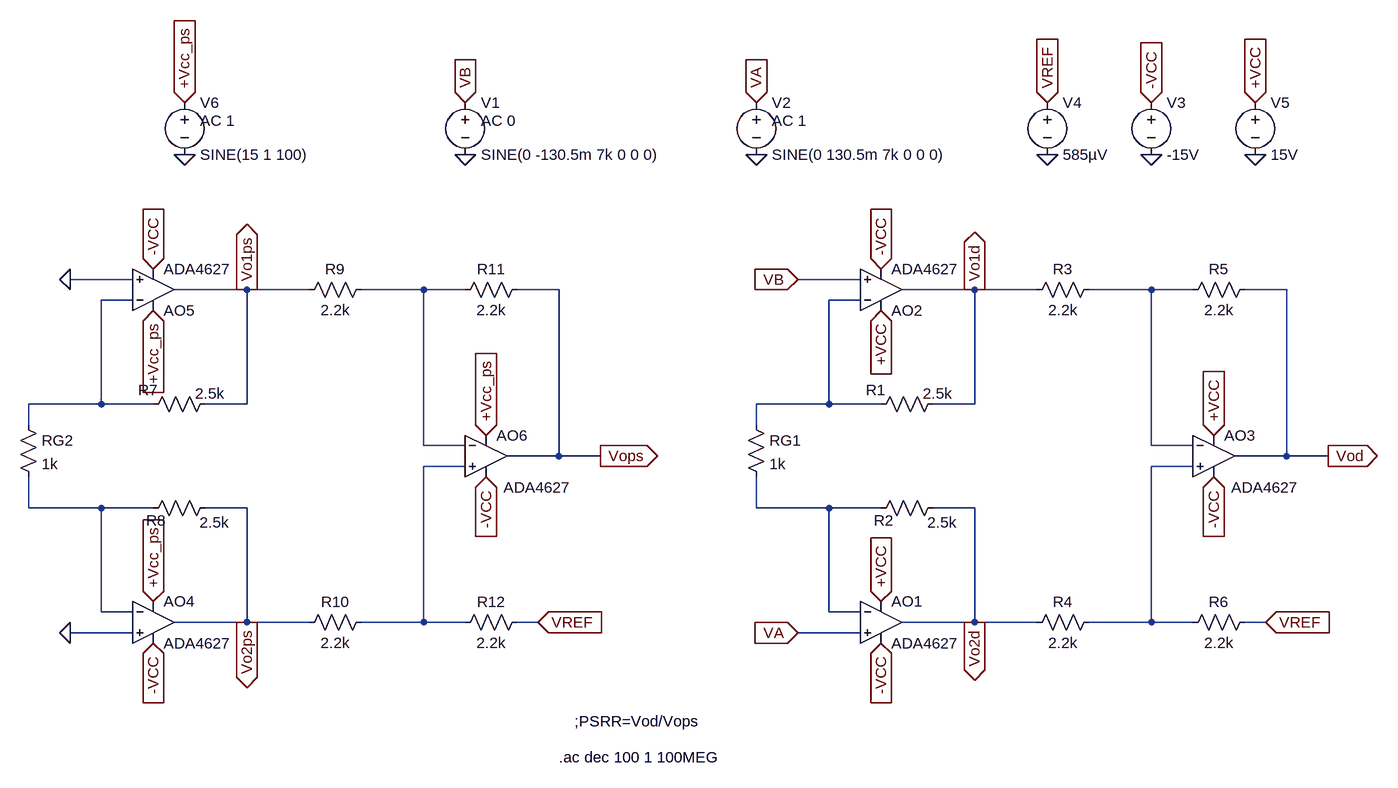
[diagram p0: schematic PSRR.asc]
PSRR.asc, the LTspice schematic file:
Version 4.1
SHEET 1 880 680
WIRE -1760 -160 -1856 -160
WIRE -640 -160 -736 -160
WIRE -1584 -144 -1696 -144
WIRE -1488 -144 -1584 -144
WIRE -1312 -144 -1408 -144
WIRE -1248 -144 -1312 -144
WIRE -1104 -144 -1168 -144
WIRE -464 -144 -576 -144
WIRE -368 -144 -464 -144
WIRE -192 -144 -288 -144
WIRE -128 -144 -192 -144
WIRE 16 -144 -48 -144
WIRE -1760 -128 -1808 -128
WIRE -640 -128 -688 -128
WIRE -1808 32 -1808 -128
WIRE -1808 32 -1920 32
WIRE -1728 32 -1808 32
WIRE -1584 32 -1584 -144
WIRE -1584 32 -1648 32
WIRE -688 32 -688 -128
WIRE -688 32 -800 32
WIRE -608 32 -688 32
WIRE -464 32 -464 -144
WIRE -464 32 -528 32
WIRE -1920 64 -1920 32
WIRE -800 64 -800 32
WIRE -1312 96 -1312 -144
WIRE -1248 96 -1312 96
WIRE -192 96 -192 -144
WIRE -128 96 -192 96
WIRE -1104 112 -1104 -144
WIRE -1104 112 -1184 112
WIRE -1040 112 -1104 112
WIRE 16 112 16 -144
WIRE 16 112 -64 112
WIRE 80 112 16 112
WIRE -1248 128 -1312 128
WIRE -128 128 -192 128
WIRE -1920 192 -1920 144
WIRE -1808 192 -1920 192
WIRE -1728 192 -1808 192
WIRE -1584 192 -1648 192
WIRE -800 192 -800 144
WIRE -688 192 -800 192
WIRE -608 192 -688 192
WIRE -464 192 -528 192
WIRE -1808 352 -1808 192
WIRE -1760 352 -1808 352
WIRE -688 352 -688 192
WIRE -640 352 -688 352
WIRE -1584 368 -1584 192
WIRE -1584 368 -1696 368
WIRE -1488 368 -1584 368
WIRE -1312 368 -1312 128
WIRE -1312 368 -1408 368
WIRE -1248 368 -1312 368
WIRE -1136 368 -1168 368
WIRE -464 368 -464 192
WIRE -464 368 -576 368
WIRE -368 368 -464 368
WIRE -192 368 -192 128
WIRE -192 368 -288 368
WIRE -128 368 -192 368
WIRE -16 368 -48 368
WIRE -1760 384 -1856 384
WIRE -640 384 -736 384
FLAG -736 -160 VB
IOPIN -736 -160 In
FLAG -736 384 VA
IOPIN -736 384 In
FLAG -608 -176 -VCC
IOPIN -608 -176 In
FLAG -608 -112 +VCC
IOPIN -608 -112 In
FLAG -608 400 -VCC
IOPIN -608 400 In
FLAG -608 336 +VCC
IOPIN -608 336 In
FLAG -16 368 VREF
IOPIN -16 368 In
FLAG -464 -144 Vo1d
IOPIN -464 -144 Out
FLAG -464 368 Vo2d
IOPIN -464 368 Out
FLAG -96 144 -VCC
IOPIN -96 144 In
FLAG -96 80 +VCC
IOPIN -96 80 In
FLAG 80 112 Vod
IOPIN 80 112 Out
FLAG -1248 -352 0
FLAG -1248 -432 VB
IOPIN -1248 -432 In
FLAG -800 -352 0
FLAG -800 -432 VA
IOPIN -800 -432 In
FLAG -192 -352 0
FLAG -32 -352 0
FLAG -32 -432 +VCC
IOPIN -32 -432 In
FLAG -192 -432 -VCC
IOPIN -192 -432 In
FLAG -352 -352 0
FLAG -352 -432 VREF
IOPIN -352 -432 In
FLAG -1728 -176 -VCC
IOPIN -1728 -176 In
FLAG -1728 400 -VCC
IOPIN -1728 400 In
FLAG -1136 368 VREF
IOPIN -1136 368 In
FLAG -1584 -144 Vo1ps
IOPIN -1584 -144 Out
FLAG -1584 368 Vo2ps
IOPIN -1584 368 Out
FLAG -1216 144 -VCC
IOPIN -1216 144 In
FLAG -1040 112 Vops
IOPIN -1040 112 Out
FLAG -1856 384 0
FLAG -1856 -160 0
FLAG -1680 -352 0
FLAG -1680 -432 +Vcc_ps
IOPIN -1680 -432 In
FLAG -1728 -112 +Vcc_ps
IOPIN -1728 -112 In
FLAG -1216 80 +Vcc_ps
IOPIN -1216 80 In
FLAG -1728 336 +Vcc_ps
IOPIN -1728 336 In
DATAFLAG 16 112 ""
DATAFLAG -1104 112 ""
SYMBOL OpAmps\\ADA4627 -608 304 R0
SYMATTR InstName AO1
SYMBOL OpAmps\\ADA4627 -608 -80 M180
SYMATTR InstName AO2
SYMBOL OpAmps\\ADA4627 -96 48 R0
WINDOW 3 27 112 Left 2
SYMATTR InstName AO3
SYMBOL res -512 16 R90
WINDOW 0 10 104 VBottom 2
WINDOW 3 -16 9 VTop 2
SYMATTR InstName R1
SYMATTR Value 2.5k
SYMBOL res -512 176 R90
WINDOW 0 51 92 VBottom 2
WINDOW 3 23 2 VTop 2
SYMATTR InstName R2
SYMATTR Value 2.5k
SYMBOL res -816 48 R0
SYMATTR InstName RG1
SYMATTR Value 1k
SYMBOL res -272 -160 R90
WINDOW 0 0 56 VBottom 2
WINDOW 3 32 56 VTop 2
SYMATTR InstName R3
SYMATTR Value 2.2k
SYMBOL res -272 352 R90
WINDOW 0 0 56 VBottom 2
WINDOW 3 32 56 VTop 2
SYMATTR InstName R4
SYMATTR Value 2.2k
SYMBOL res -32 -160 R90
WINDOW 0 0 56 VBottom 2
WINDOW 3 32 56 VTop 2
SYMATTR InstName R5
SYMATTR Value 2.2k
SYMBOL res -32 352 R90
WINDOW 0 0 56 VBottom 2
WINDOW 3 32 56 VTop 2
SYMATTR InstName R6
SYMATTR Value 2.2k
SYMBOL voltage -1248 -448 R0
WINDOW 123 24 44 Left 2
WINDOW 39 0 0 Left 0
SYMATTR Value2 AC 0
SYMATTR InstName V1
SYMATTR Value SINE(0 -130.5m 7k 0 0 0)
SYMBOL voltage -800 -448 R0
WINDOW 123 24 44 Left 2
WINDOW 39 0 0 Left 0
SYMATTR Value2 AC 1
SYMATTR InstName V2
SYMATTR Value SINE(0 130.5m 7k 0 0 0)
SYMBOL voltage -192 -448 R0
WINDOW 123 0 0 Left 0
WINDOW 39 0 0 Left 0
SYMATTR InstName V3
SYMATTR Value -15V
SYMBOL voltage -352 -448 R0
WINDOW 123 0 0 Left 0
WINDOW 39 0 0 Left 0
SYMATTR InstName V4
SYMATTR Value 585µV
SYMBOL voltage -32 -448 R0
WINDOW 123 24 44 Left 2
WINDOW 39 0 0 Left 0
SYMATTR InstName V5
SYMATTR Value 15V
SYMBOL OpAmps\\ADA4627 -1728 304 R0
SYMATTR InstName AO4
SYMBOL OpAmps\\ADA4627 -1728 -80 M180
SYMATTR InstName AO5
SYMBOL OpAmps\\ADA4627 -1216 48 R0
WINDOW 3 27 112 Left 2
SYMATTR InstName AO6
SYMBOL res -1632 16 R90
WINDOW 0 10 104 VBottom 2
WINDOW 3 -16 9 VTop 2
SYMATTR InstName R7
SYMATTR Value 2.5k
SYMBOL res -1632 176 R90
WINDOW 0 51 92 VBottom 2
WINDOW 3 23 2 VTop 2
SYMATTR InstName R8
SYMATTR Value 2.5k
SYMBOL res -1936 48 R0
SYMATTR InstName RG2
SYMATTR Value 1k
SYMBOL res -1392 -160 R90
WINDOW 0 0 56 VBottom 2
WINDOW 3 32 56 VTop 2
SYMATTR InstName R9
SYMATTR Value 2.2k
SYMBOL res -1392 352 R90
WINDOW 0 0 56 VBottom 2
WINDOW 3 32 56 VTop 2
SYMATTR InstName R10
SYMATTR Value 2.2k
SYMBOL res -1152 -160 R90
WINDOW 0 0 56 VBottom 2
WINDOW 3 32 56 VTop 2
SYMATTR InstName R11
SYMATTR Value 2.2k
SYMBOL res -1152 352 R90
WINDOW 0 0 56 VBottom 2
WINDOW 3 32 56 VTop 2
SYMATTR InstName R12
SYMATTR Value 2.2k
SYMBOL voltage -1680 -448 R0
WINDOW 123 24 44 Left 2
WINDOW 39 0 0 Left 0
SYMATTR Value2 AC 1
SYMATTR InstName V6
SYMATTR Value SINE(15 1 100)
TEXT -1104 576 Left 2 !.ac dec 100 1 100MEG
TEXT -1080 520 Left 2 !;PSRR=Vod/Vops

The netlist it stands for:
* PSRR.asc
X§AO1 VA N008 +VCC -VCC Vo2d ADA4627  ; pins In+ In- V+ V- OUT
X§AO2 VB N004 +VCC -VCC Vo1d ADA4627  ; pins In+ In- V+ V- OUT
X§AO3 N006 N002 +VCC -VCC Vod ADA4627  ; pins In+ In- V+ V- OUT
R1 Vo1d N004 2.5k
R2 Vo2d N008 2.5k
RG1 N004 N008 1k
R3 N002 Vo1d 2.2k
R4 N006 Vo2d 2.2k
R5 Vod N002 2.2k
R6 VREF N006 2.2k
V1 VB 0 SINE(0 -130.5m 7k 0 0 0) AC 0
V2 VA 0 SINE(0 130.5m 7k 0 0 0) AC 1
V3 -VCC 0 -15V
V4 VREF 0 585µV
V5 +VCC 0 15V
X§AO4 0 N007 +Vcc_ps -VCC Vo2ps ADA4627  ; pins In+ In- V+ V- OUT
X§AO5 0 N003 +Vcc_ps -VCC Vo1ps ADA4627  ; pins In+ In- V+ V- OUT
X§AO6 N005 N001 +Vcc_ps -VCC Vops ADA4627  ; pins In+ In- V+ V- OUT
R7 Vo1ps N003 2.5k
R8 Vo2ps N007 2.5k
RG2 N003 N007 1k
R9 N001 Vo1ps 2.2k
R10 N005 Vo2ps 2.2k
R11 Vops N001 2.2k
R12 VREF N005 2.2k
V6 +Vcc_ps 0 SINE(15 1 100) AC 1
.ac dec 100 1 100MEG
;PSRR=Vod/Vops
.backanno
.end